# Altium schematic sheet Aixcel_Tiny_STLink_Board.SchDoc
size A4; Organization: Altium Limited; Address1: L3, 12a Rodborough Rd; Address2: Frenchs Forest; Address3: NSW; Address4: Australia 2086; DocumentNumber: 01; Revision: 01; SheetNumber: 1; SheetTotal: 4
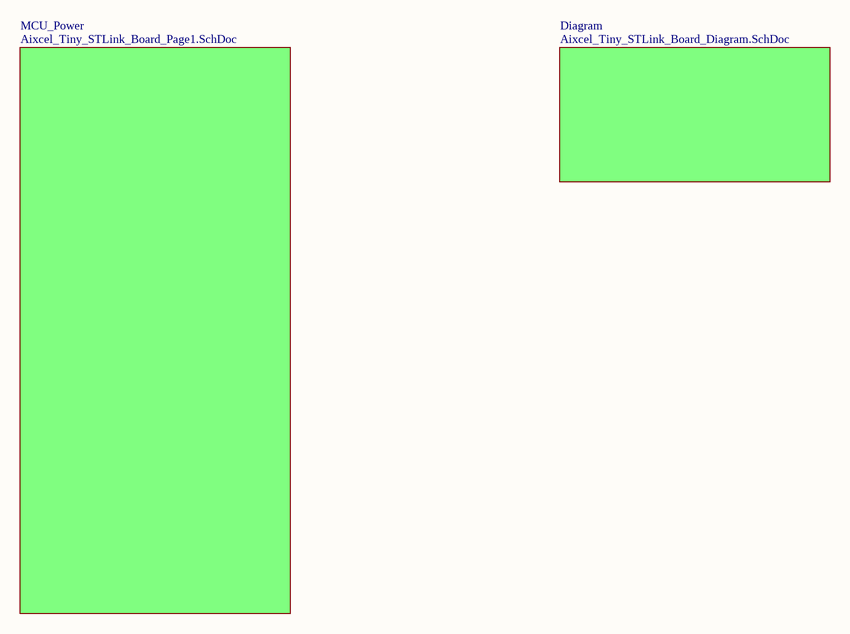
[diagram p0: Aixcel_Tiny_STLink_Board.SchDoc]

## Sub-sheets
Diagram = Aixcel_Tiny_STLink_Board_Diagram.SchDoc: no entries
MCU_Power = Aixcel_Tiny_STLink_Board_Page1.SchDoc: no entries

## Notes on the sheet
- Size:
- Model Name:
- A4
- Number:
- Revision:
- Aixcel Limited
- Guass Rd At Pudong
- ShangHai China +86
- Date:
- Time:
- Sheet
- of
- www.Aixcel.net <http://www.Aixcel.net>